# EAGLE design WakeUpLight (EAGLE 9.6.2)
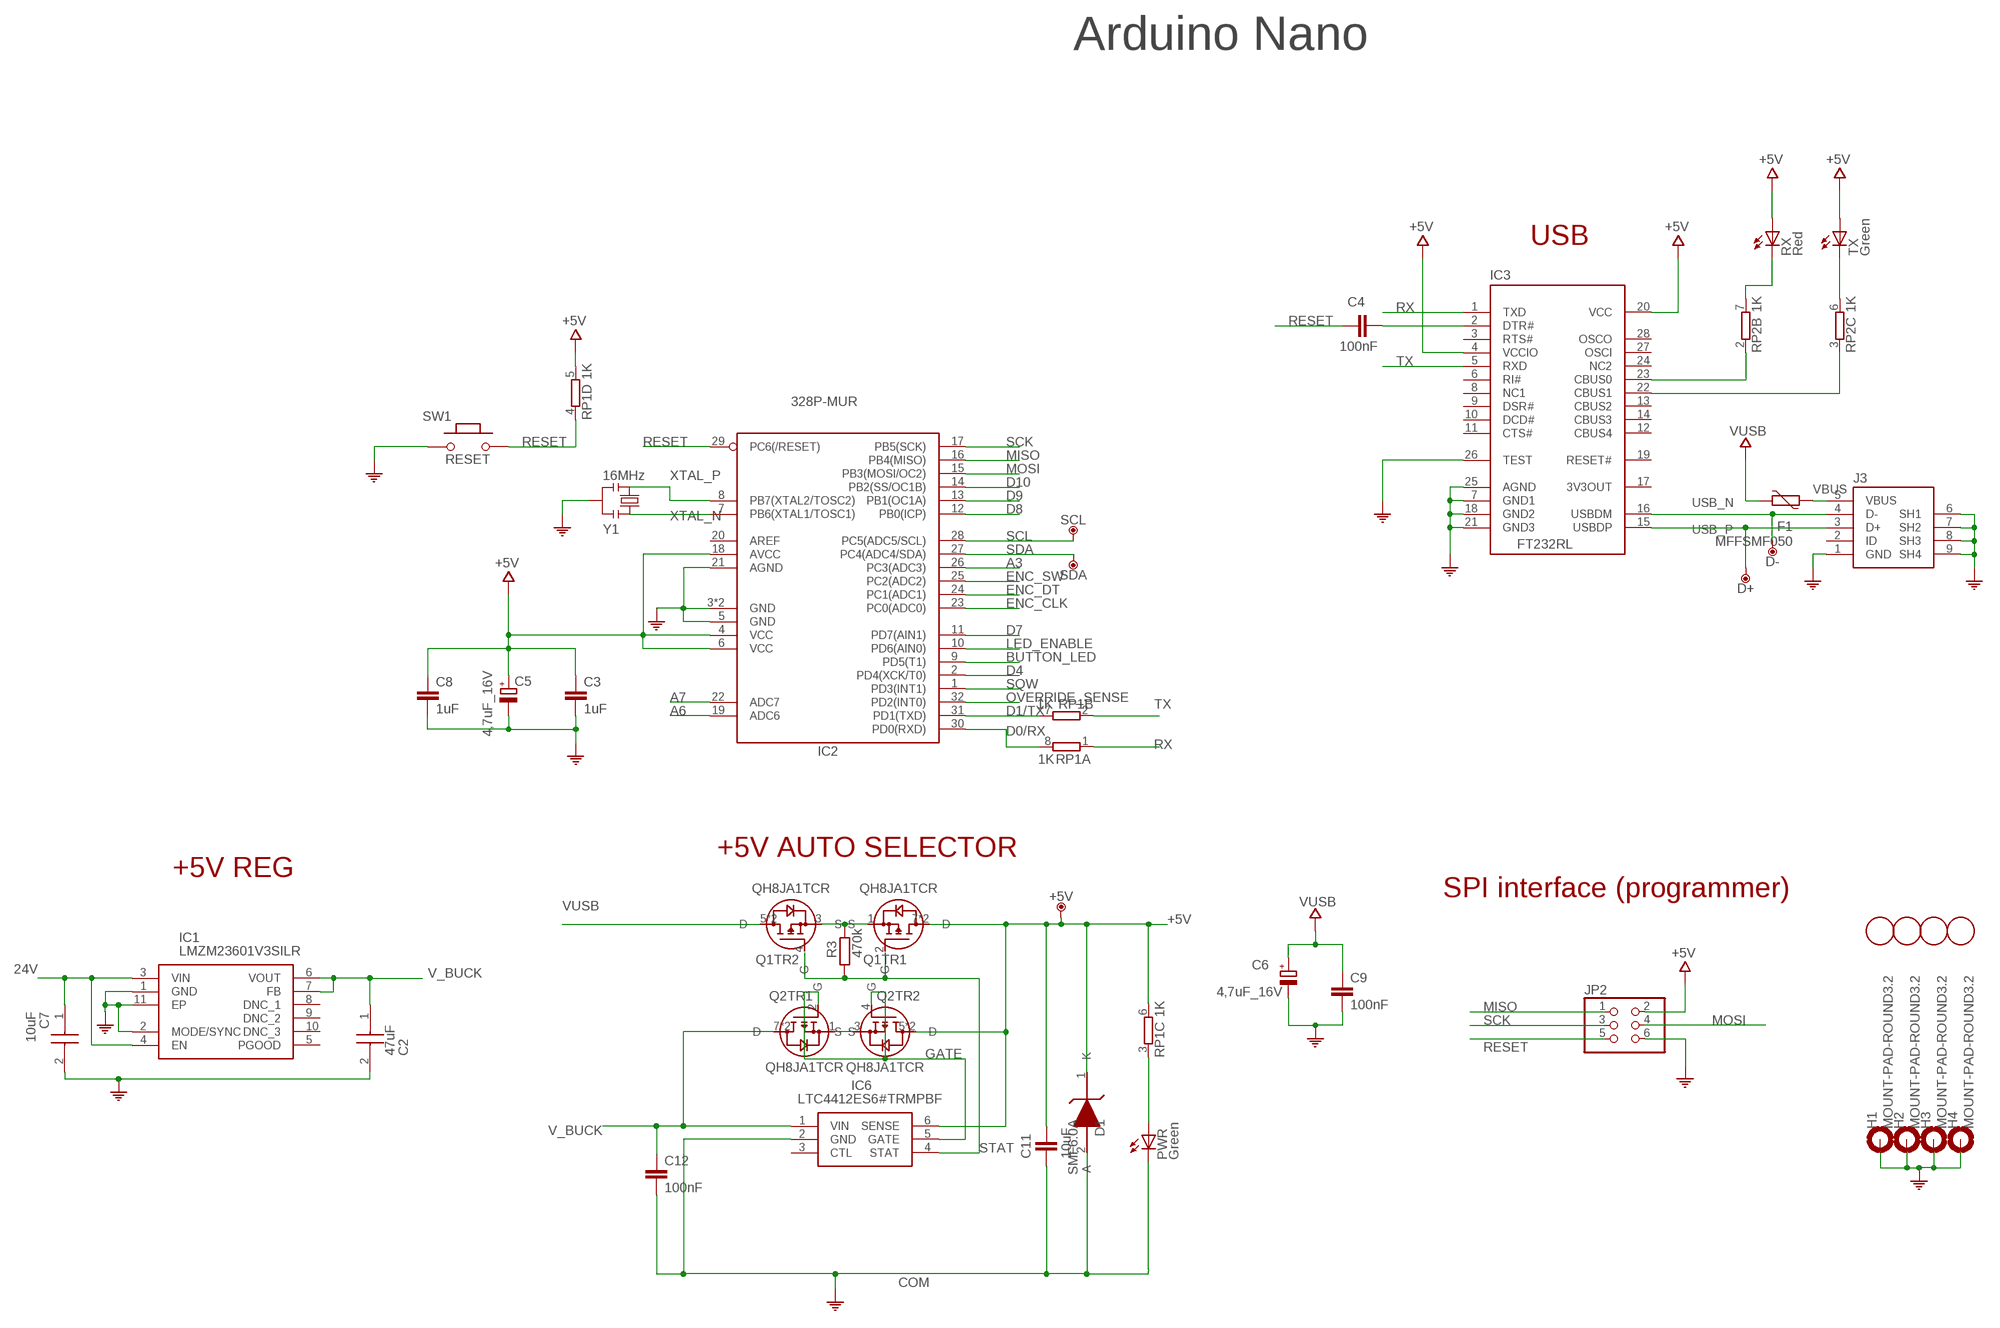
[diagram p0: schematic, sheet 1, part 1 of 2]
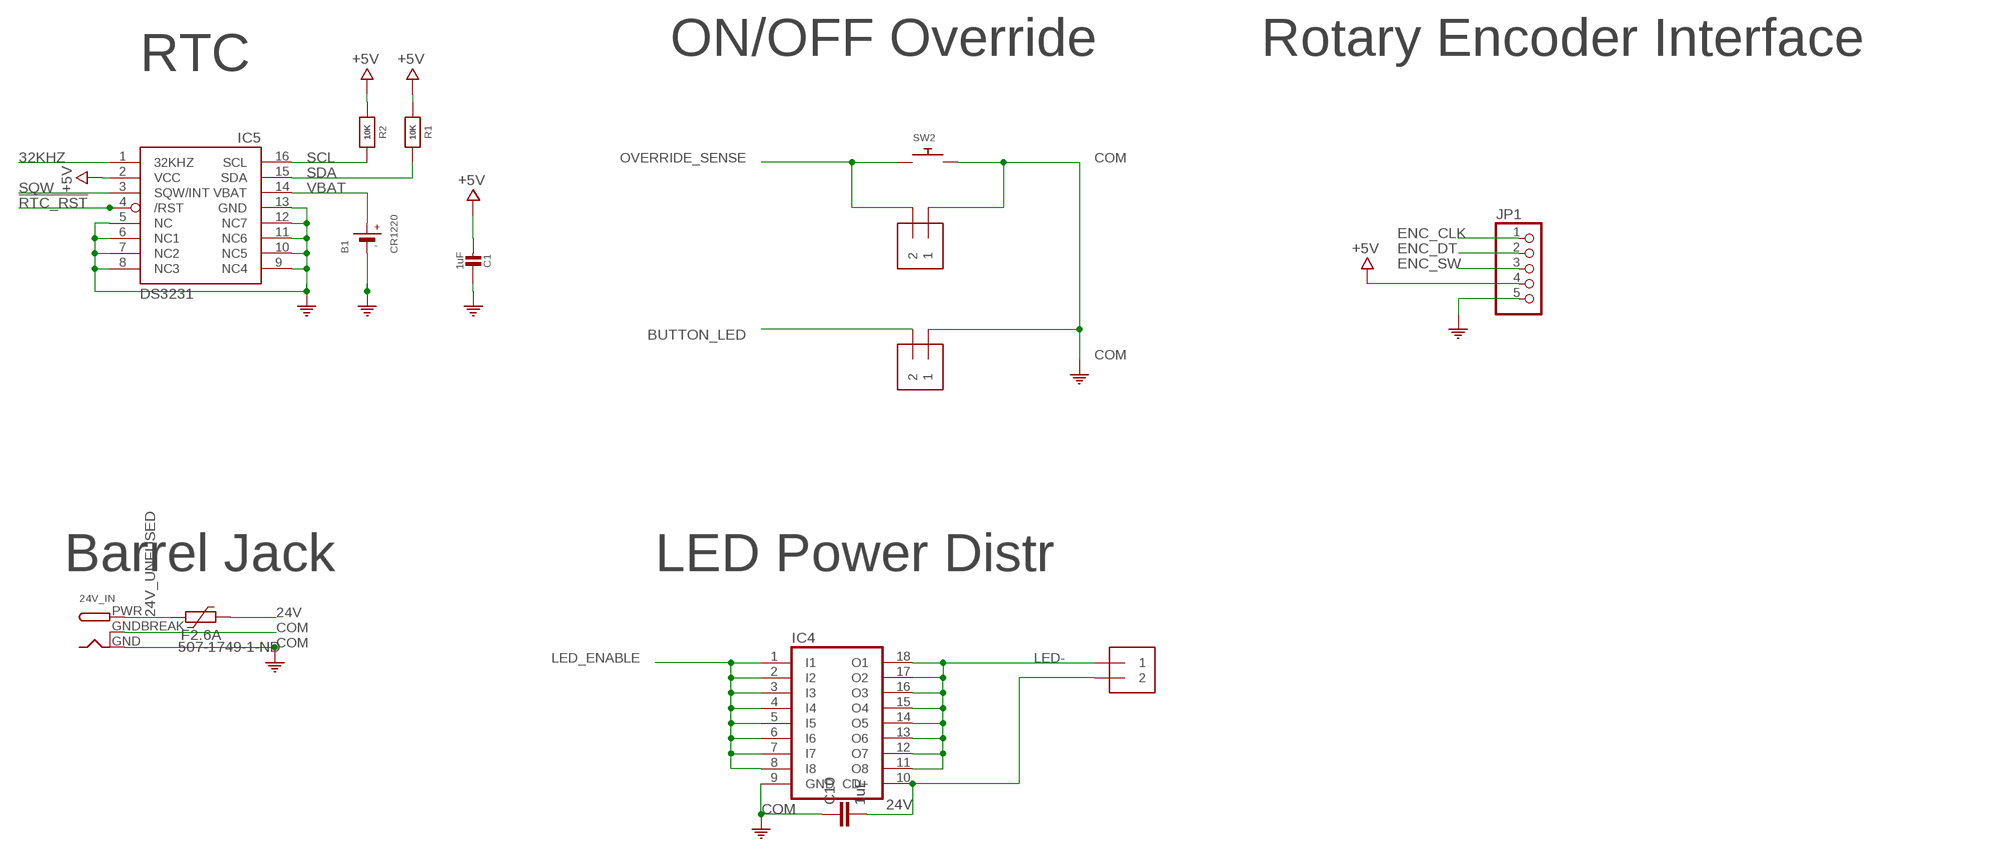
[diagram p1: schematic, sheet 1, part 2 of 2]

## Parts
24V_IN  DCBARRELPTH  [DCJACK_2MM_PTH]
+5V  DNP  TPTP-1.00MM  [TP-1.00MM]
B1  CR1220  BATTERYCR1220_SMT  [CR1220]
BUTTON_LED  1X2-3.5MM  [1X2-3.5MM]
C1  1uF  CAP_CERAMIC0805-NOOUTLINE  [0805-NO]
C2  47uF  C3216X5R1E476M160AC  [CAPC3216X180N]
C3  1uF  0006_1UF_0603/GRM188R61E105KA12D  [C0603-ROUND]
C4  100nF  0015_100NF_0603  [C0603-ROUND]
C5  4,7uF_16V  0833_TAJA475MO16RNJ  [TAN-A]
C6  4,7uF_16V  0833_TAJA475MO16RNJ  [TAN-A]
C7  10uF  C2012X5R1V106K085AC  [CAPC2012X100N]
C8  1uF  0006_1UF_0603/GRM188R61E105KA12D  [C0603-ROUND]
C9  100nF  0015_100NF_0603  [C0603-ROUND]
C10  1uF  0006_1UF_0603/GRM188R61E105KA12D  [C0603-ROUND]
C11  10uF  CC0603  [C0603]
C12  100nF  0015_100NF_0603  [C0603-ROUND]
D1  SMF6.0A  [SODFL3618X108N]
D+  DNP  TPTP-1.00MM  [TP-1.00MM]
D-  DNP  TPTP-1.00MM  [TP-1.00MM]
F1  MFFSMF050  PTC  [0603-1608X90N]
F2.6A  507-1749-1-ND  2016L260/24  [2016L]
H1  MOUNT-PAD-ROUND3.2  [3,2-PAD]
H2  MOUNT-PAD-ROUND3.2  [3,2-PAD]
H3  MOUNT-PAD-ROUND3.2  [3,2-PAD]
H4  MOUNT-PAD-ROUND3.2  [3,2-PAD]
IC1  LMZM23601V3SILR  [LMZM23600SILT]
IC2  328P-MUR  ATMEGA328P-32MUR  [VQFN32]
IC3  FT232RL  0226_FT232RL  [SSOP28]
IC4  ULN2803ASMT  [SO18W]
IC5  DS3231/SO  [SO16W]
IC6  LTC4412ES6#TRMPBF  [SOT95P280X100-6N]
J3  0219_14850  [USB-MINI-B_2]
JP1  PINHD-1X5  [1X05]
JP2  0114_PH254-203DF118A00V  [2X03]
LED  1X2-3.5MM  [1X2-3.5MM]
OVERRIDE  1X2-3.5MM  [1X2-3.5MM]
PWR  Green  0043_KPT-2012SGC  [CHIPLED_0805]
Q1  QH8JA1TCR  [SOTFL65P280X85-8N]
Q2  QH8JA1TCR  [SOTFL65P280X85-8N]
R1  10K  RESISTOR0805_NOOUTLINE  [0805-NO]
R2  10K  RESISTOR0805_NOOUTLINE  [0805-NO]
R3  470k  RR0603  [R0603]
RP1  1K  0005_064R_1K_/_CAY16-102J4LF  [CAY16]
RP2  1K  0005_064R_1K_/_CAY16-102J4LF  [CAY16]
RX  Red  0181_KTP-2012SURCK  [CHIPLED_0805]
SCL  DNP  TPTP-1.00MM  [TP-1.00MM]
SDA  DNP  TPTP-1.00MM  [TP-1.00MM]
SW1  RESET  0173_IT-1185AP1C-160G-G_T&R  [SMD_157SW]
SW2  SWITCH_PUSHBUTTONSOFTTOUCHSMD_SJ  [PUSHBUTTON_SMD_SJ]
TX  Green  0043_KPT-2012SGC  [CHIPLED_0805]
U$36  DNP  FIDUCIAL-1.5MM  [FD-1-1.5]
U$39  DNP  FIDUCIAL-1.5MM  [FD-1-1.5]
U$53  DNP  FIDUCIAL-1.5MM  [FD-1-1.5]
U$54  DNP  FIDUCIAL-1.5MM  [FD-1-1.5]
Y1  16MHz  0011_CSTCE16M0V53-R0  [RESONATOR]

## Nets
24V [hipower]: C7.1 C10.2 F2.6A.2 IC1.3(VIN) IC1.4(EN) IC4.10(CD+) LED.2
24V_UNFUSED: 24V_IN.PWR F2.6A.1
32KHZ: IC5.1(32KHZ)
!RTC_RST: IC5.4(/RST)
+5V [power]: +5V.X C1.2 C3.1 C5.1(+) C8.1 C11.1 D1.1(K) IC2.4(VCC) IC2.6(VCC) IC2.18(AVCC) IC3.4(VCCIO) IC3.20(VCC) IC5.2(VCC) IC6.6(SENSE) JP1.4 JP2.2 Q1.7(TR1:D) Q1.8(TR1:D) Q2.5(TR2:D) Q2.6(TR2:D) R1.1 R2.1 RP1.5 RP1.6 RX.A TX.A
A3: IC2.26(PC3(ADC3))
A6: IC2.19(ADC6)
A7: IC2.22(ADC7)
BUTTON_LED: BUTTON_LED.2 IC2.9(PD5(T1))
COM [power]: 24V_IN.GND 24V_IN.GNDBREAK B1.- BUTTON_LED.1 C1.1 C2.2 C3.2 C5.2(-) C6.2(-) C7.2 C8.2 C9.2 C10.1 C11.2 C12.2 D1.2(A) H1.B3,2(MOUNT) H2.B3,2(MOUNT) H3.B3,2(MOUNT) H4.B3,2(MOUNT) IC1.1(GND) IC1.2(MODE/SYNC) IC1.11(EP) IC2.3(GND) IC2.5(GND) IC2.21(AGND) IC2.33(GND) IC3.7(GND1) IC3.18(GND2) IC3.21(GND3) IC3.25(AGND) IC3.26(TEST) IC4.9(GND) IC5.5(NC) IC5.6(NC1) IC5.7(NC2) IC5.8(NC3) IC5.9(NC4) IC5.10(NC5) IC5.11(NC6) IC5.12(NC7) IC5.13(GND) IC6.2(GND) J3.1(GND) J3.6(SH1) J3.7(SH2) J3.8(SH3) J3.9(SH4) JP1.5 JP2.6 OVERRIDE.1 PWR.C SW1.1 SW2.P$2 Y1.2
D0/RX: IC2.30(PD0(RXD)) RP1.8
D1/TX: IC2.31(PD1(TXD)) RP1.7
D4: IC2.2(PD4(XCK/T0))
D7: IC2.11(PD7(AIN1))
D8: IC2.12(PB0(ICP))
D9: IC2.13(PB1(OC1A))
D10: IC2.14(PB2(SS/OC1B))
ENC_CLK: IC2.23(PC0(ADC0)) JP1.1
ENC_DT: IC2.24(PC1(ADC1)) JP1.2
ENC_SW: IC2.25(PC2(ADC2)) JP1.3
GATE: IC6.5(GATE) Q2.2(TR1:G) Q2.4(TR2:G)
LED- [hipower]: IC4.11(O8) IC4.12(O7) IC4.13(O6) IC4.14(O5) IC4.15(O4) IC4.16(O3) IC4.17(O2) IC4.18(O1) LED.1
LED_ENABLE: IC2.10(PD6(AIN0)) IC4.1(I1) IC4.2(I2) IC4.3(I3) IC4.4(I4) IC4.5(I5) IC4.6(I6) IC4.7(I7) IC4.8(I8)
MISO: IC2.16(PB4(MISO)) JP2.1
MOSI: IC2.15(PB3(MOSI/OC2)) JP2.4
N$1: Q1.1(TR1:S) Q1.3(TR2:S) R3.2
N$3: PWR.A RP1.3
N$4: C4.2 IC3.2(DTR#)
N$8: IC3.23(CBUS0) RP2.2
N$9: IC3.22(CBUS1) RP2.3
N$11: RP2.6 TX.C
N$18: Q2.1(TR1:S) Q2.3(TR2:S)
N$29: RP2.7 RX.C
OVERRIDE_SENSE: IC2.32(PD2(INT0)) OVERRIDE.2 SW2.P$1
RESET: C4.1 IC2.29(PC6(/RESET)) JP2.5 RP1.4 SW1.2
RX: IC3.1(TXD) RP1.1
SCK: IC2.17(PB5(SCK)) JP2.3
SCL: IC2.28(PC5(ADC5/SCL)) IC5.16(SCL) R2.2 SCL.X
SDA: IC2.27(PC4(ADC4/SDA)) IC5.15(SDA) R1.2 SDA.X
SQW: IC2.1(PD3(INT1)) IC5.3(SQW/INT)
STAT: IC6.4(STAT) Q1.2(TR1:G) Q1.4(TR2:G) R3.1
TX: IC3.5(RXD) RP1.2
USB_N [differential-pair]: D-.X IC3.16(USBDM) J3.4(D-)
USB_P [differential-pair]: D+.X IC3.15(USBDP) J3.3(D+)
V_BUCK [power]: C2.1 C12.1 IC1.6(VOUT) IC1.7(FB) IC6.1(VIN) Q2.7(TR1:D) Q2.8(TR1:D)
VBAT [power]: B1.+$1(+) IC5.14(VBAT)
VBUS [power]: F1.2 J3.5(VBUS)
VUSB [power]: C6.1(+) C9.1 F1.1 Q1.5(TR2:D) Q1.6(TR2:D)
XTAL_N: IC2.7(PB6(XTAL1/TOSC1)) Y1.1
XTAL_P: IC2.8(PB7(XTAL2/TOSC2)) Y1.3
Unconnected: IC1.5(PGOOD) IC1.8(DNC_1) IC1.9(DNC_2) IC1.10(DNC_3) IC2.20(AREF) IC3.3(RTS#) IC3.6(RI#) IC3.8(NC1) IC3.9(DSR#) IC3.10(DCD#) IC3.11(CTS#) IC3.12(CBUS4) IC3.13(CBUS2) IC3.14(CBUS3) IC3.19(RESET#) IC3.24(NC2) IC3.27(OSCI) IC3.28(OSCO) IC6.3(CTL) J3.2(ID) RP2.1 RP2.4 RP2.5 RP2.8

## Notes on the sheet
- Arduino Nano
- USB
- RTC | ON/OFF Override | Rotary Encoder Interface
- +5V AUTO SELECTOR
- +5V REG
- SPI interface (programmer)
- Barrel Jack | LED Power Distr

## Power pins joined to a net without a drawn wire
3V3OUT: IC3.17(3V3OUT)

## Library data of the parts
24V_IN = adafruit:DCBARREL: 2.0mm DC Barrel Jack DCJACK_2MM_PTH - Through Hole Jack (4UConnector: 05537)
+5V D+ D- SCL SDA = Arduino-utility:TP: Testpoint; DATASHEET: DNP; DISTRIBUTOR-LINK: DNP; DISTRIBUTOR-PN: DNP; MANUFACTURER: DNP; MANUFACTURER-PN: DNP
B1 = microbuilder:BATTERY: CR1220 SMT - Digikey: 3001K-ND CD2032 BAT-HLD-001 - Digikey: BAT-HLD-001-ND
BUTTON_LED LED OVERRIDE = adafruit:1X2: 3.5mm Terminal block http://www.ladyada.net/library/pcb/eaglelibrary.html
C1 = microbuilder:CAP_CERAMIC: Ceramic Capacitors For new designs, use the packages preceded by an '_' character since they are more reliable: The following footprints should be used on most boards: _0402 - Standard footprint for regular board layouts _0603 - Standard footprint for regular board layouts _0805 - Standard footprint for regular board layouts _1206 - Standard footprint for regular board layouts For extremely tight-pitch boards where space is at a premium, the following 'micro-pitch' footprints can be used (smaller pads, no silkscreen outline, etc.): _0402MP - Micro-pitch footprint for very dense/compact boards _0603MP - Micro-pitch footprint for very dense/compact boards _0805MP - Micro-pitch footprint for very dense/compact boards _1206MP - Micro-pitch footprint for very dense/compact boards
C2 = SamacSys_Parts:C3216X5R1E476M160AC: 1206 X5R ceramic capacitor 47uF 25V TDK 1206 C 47??F Ceramic Multilayer Capacitor, 25 V dc X5R Dielectric ??20% SMD Source: Datasheet <https://product.tdk.com/info/en/catalog/datasheets/mlcc_commercial_midvoltage_en.pdf>; ARROW_PART_NUMBER: C3216X5R1E476M160AC; ARROW_PRICE-STOCK: https://www.arrow.com/en/products/c3216x5r1e476m160ac/tdk; DESCRIPTION: 1206 X5R ceramic capacitor 47uF 25V TDK 1206 C 47??F Ceramic Multilayer Capacitor, 25 V dc X5R Dielectric ??20% SMD; HEIGHT: 1.8mm; MANUFACTURER_NAME: TDK; MANUFACTURER_PART_NUMBER: C3216X5R1E476M160AC; MOUSER_PART_NUMBER: 810-C3216X5R1E476M; MOUSER_PRICE-STOCK: https://www.mouser.co.uk/ProductDetail/TDK/C3216X5R1E476M160AC?qs=NRhsANhppD%252BqapdVvBvu4Q%3D%3D
C3 C8 C10 = Condensatori:0006_1UF_0603/GRM188R61E105KA12D: 1uF 0603; CASE: 0603; MONTHLY_USAGE: _____; PART_NUMBER: 1uF_0603/GRM188R61E105KA12D; PRICE: _____; SUPPLIER: _____; TYPE: Condensatori
C4 C9 C12 = Condensatori:0015_100NF_0603: 100nF 0603 50V; CASE: 0603; MONTHLY_USAGE: _____; PART_NUMBER: cl10b104kbnc; PRICE: _____; SUPPLIER: _____; TYPE: Condensatori
C5 C6 = Condensatori:0833_TAJA475MO16RNJ: 4,7uF; CASE: Case_A_(1206); MONTHLY_USAGE: _____; PART_NUMBER: TAJA475MO16RNJ; PRICE: _____; SUPPLIER: _____; TYPE: Condensatori
C7 = SamacSys_Parts:C2012X5R1V106K085AC: Capacitor MLCC 0805 35V 10uF X5R TDK 10uF Multilayer Ceramic Capacitor (MLCC) 35 V dc +/-10% X5R dielectric C SMT max op. temp. +85C Source: Datasheet <https://product.tdk.com/en/search/capacitor/ceramic/mlcc/info?part_no=C2012X5R1V106K085AC>; ARROW_PART_NUMBER: C2012X5R1V106K085AC; ARROW_PRICE-STOCK: https://www.arrow.com/en/products/c2012x5r1v106k085ac/tdk; DESCRIPTION: Capacitor MLCC 0805 35V 10uF X5R TDK 10uF Multilayer Ceramic Capacitor (MLCC) 35 V dc +/-10% X5R dielectric C SMT max op. temp. +85C; HEIGHT: 1mm; MANUFACTURER_NAME: TDK; MANUFACTURER_PART_NUMBER: C2012X5R1V106K085AC; MOUSER_PART_NUMBER: 810-C2012X5R1V106K0C; MOUSER_PRICE-STOCK: https://www.mouser.co.uk/ProductDetail/TDK/C2012X5R1V106K085AC?qs=6JAMGB%252BEdky%252BlYMcTLhFyA%3D%3D
C11 = eagle-ltspice:C: CAPACITOR, European symbol; MPN: GRM188R61E106MA73D; POPULATE: 1; SPICEMODEL: NONE; SPICEPREFIX: C
D1 = SamacSys_Parts:SMF: ESD Suppressors / TVS Diodes TVS SMF Uni-Directional Source: Datasheet <https://www.littelfuse.com/~/media/electronics/datasheets/tvs_diodes/littelfuse_tvs_diode_smf_datasheet.pdf.pdf>; DIGIKEY-PN: F5749CT-ND; POPULATE: 1
F1 = Arduino-rcl:PTC: SMD PTC; DATASHEET: http://www.bourns.com/docs/Product-Datasheets/mffsmf.pdf; DISTRIBUTOR-LINK: http://www.digikey.com/product-detail/en/bourns-inc/MF-FSMF050X-2/MF-FSMF050X-2CT-ND/2039389; DISTRIBUTOR-PN: MF-FSMF050X-2CT-ND; MANUFACTURER: Bourns Inc; MANUFACTURER-PN: MF-FSMF050X-2
F2.6A = polyfuse-smd_20:?: Polyfuse Resettable PTC Source: http://www.littelfuse.com/products/resettable-ptcs.aspx; MF: Littelfuse; MPN: 0ZCF0200AF2C; OC_FARNELL: unknown; OC_NEWARK: unknown
H1-H4 = holes:MOUNT-PAD-ROUND: MOUNTING PAD, round
IC1 = SamacSys_Parts:LMZM23601V3SILR: 36-V, 1-A Step-Down DC-DC Power Module in 3.8-mm 3-mm Package Source: Datasheet <http://www.ti.com/lit/ds/symlink/lmzm23601.pdf>; ARROW_PART_NUMBER: LMZM23601V3SILR; ARROW_PRICE-STOCK: https://www.arrow.com/en/products/lmzm23601v3silr/texas-instruments; DESCRIPTION: 36-V, 1-A Step-Down DC-DC Power Module in 3.8-mm 3-mm Package; HEIGHT: 1.578mm; MANUFACTURER_NAME: Texas Instruments; MANUFACTURER_PART_NUMBER: LMZM23601V3SILR; MOUSER_PART_NUMBER: 595-LMZM23601V3SILR; MOUSER_PRICE-STOCK: https://www.mouser.co.uk/ProductDetail/Texas-Instruments/LMZM23601V3SILR?qs=W0yvOO0ixfHvtV7rqSaAlA%3D%3D
IC2 = Arduino-ucs&SoCs:ATMEGA328P-32: 8-bit Microcontroller with 32KBytes In-System Programmable Flash ATMEGA328P-AU; DATASHEET: http://www.atmel.com/images/Atmel-8271-8-bit-AVR-Microcontroller-ATmega48A-48PA-88A-88PA-168A-168PA-328-328P_datasheet_Complete.pdf; DISTRIBUTOR-LINK: https://www.digikey.it/product-detail/it/microchip-technology/ATMEGA328P-MUR/ATMEGA328P-MURCT-ND/3440953; DISTRIBUTOR-PN: ATMEGA328P-MURCT-ND; MANUFACTURER: ATMEL; MANUFACTURER-PN: ATMEGA328P-MUR
IC3 = IntegratedCircuits:0226_FT232RL: USB to serial UART interface -FT232RL; CASE: SSOP28; MONTHLY_USAGE: _____; PART_NUMBER: FT232RL; PRICE: _____; SUPPLIER: _____; TYPE: Circuito_Integrato
IC4 = uln-udn-custom:ULN2803A: DRIVER ARRAY https://www.ti.com/lit/ds/symlink/uln2803a.pdf; DATASHEET: https://www.ti.com/lit/ds/symlink/uln2803a.pdf; INPUTVOLT: 3-5V; PARALLELIO: 8
IC5 = adafruit:DS3231
IC6 = SamacSys_Parts:LTC4412ES6#TRMPBF: Hot Swap Controller LTC4412ES6#TRMPBF, Positive Voltage, 2.5 28 V, TSOT-23, 6-Pin Source: Datasheet <https://componentsearchengine.com/Datasheets/1/LTC4412ES6#TRMPBF.pdf>; DESCRIPTION: Hot Swap Controller LTC4412ES6#TRMPBF, Positive Voltage, 2.5 28 V, TSOT-23, 6-Pin; HEIGHT: 1mm; MANUFACTURER_NAME: Linear Technology; MANUFACTURER_PART_NUMBER: LTC4412ES6#TRMPBF; MOUSER_PART_NUMBER: 584-LTC4412ES6TRMPBF; MOUSER_PRICE-STOCK: https://www.mouser.com/Search/Refine.aspx?Keyword=584-LTC4412ES6TRMPBF; POPULATE: 1
J3 = Connettori:0219_14850: Usb-Mini F 90 Smd; MONTHLY_USAGE: _____; PART_NUMBER: 14850; PRICE: _____; SUPPLIER: _____; TYPE: Connettori; VALUE: USB-mini-90 -SMD
JP1 = pinhead-custom:PINHD-1X5: PIN HEADER
JP2 = Connettori:0114_PH254-203DF118A00V: 3x2 M V h 8,5 mm p2,54; MONTHLY_USAGE: _____; PART_NUMBER: PH254-203DF118A00V; PRICE: _____; SUPPLIER: _____; TYPE: Connettori; VALUE: ICSP
PWR TX = Opto:0043_KPT-2012SGC: LED GREEN - SMD-0805; MONTHLY_USAGE: _____; PART_NUMBER: KPT-2012SGC; PRICE: _____; SUPPLIER: _____; TYPE: Opto
Q1 Q2 = SamacSys_Parts:QH8JA1TCR: -20V Pch+Pch Middle Power MOSFET Source: Datasheet <https://www.mouser.com/datasheet/2/348/qh8ja1tcr-e-1138736.pdf>; DATASHEET: https://www.mouser.com/datasheet/2/348/qh8ja1tcr-e-1138736.pdf; DIGIKEY-PN: QH8JA1TCRCT-ND; MPN: QH8JA1TCR; POPULATE: 1
R1 R2 = microbuilder:RESISTOR: Resistors For new designs, use the packages preceded by an '_' character since they are more reliable: The following footprints should be used on most boards: _0402 - Standard footprint for regular board layouts _0603 - Standard footprint for regular board layouts _0805 - Standard footprint for regular board layouts _1206 - Standard footprint for regular board layouts For extremely tight-pitch boards where space is at a premium, the following 'micro-pitch' footprints can be used (smaller pads, no silkscreen outline, etc.): _0402MP - Micro-pitch footprint for very dense/compact boards _0603MP - Micro-pitch footprint for very dense/compact boards _0805MP - Micro-pitch footprint for very dense/compact boards _1206MP - Micro-pitch footprint for very dense/compact boards
R3 = eagle-ltspice:R: RESISTOR, European symbol; POPULATE: 1; SPICEMODEL: NONE; SPICEPREFIX: R
RP1 RP2 = Resistenze:0005_064R_1K_/_CAY16-102J4LF: 1K 064R; CASE: SMD_3,2x1,6; MONTHLY_USAGE: _____; PART_NUMBER: 064R_1K_/_CAY16-102J4LF; PRICE: _____; SUPPLIER: _____; TYPE: Resistenze
RX = Opto:0181_KTP-2012SURCK: LED RED - SMD - 0805; MONTHLY_USAGE: _____; PART_NUMBER: KTP-2012SURCK; PRICE: _____; SUPPLIER: _____; TYPE: Opto
SW1 = Switches:0173_IT-1185AP1C-160G-G_T&R: Pushbutton 4x3 SMD H2,5mm; MONTHLY_USAGE: _____; PART_NUMBER: IT-1185AP1C-160G-G_T&R; PRICE: _____; SUPPLIER: _____; TYPE: Switches; VALUE: 157SW
SW2 = adafruit:SWITCH_PUSHBUTTON: Buttons SOFTTOUCHSMD_SJ - Soft touch temporary push button (Super Junk Akihabara) Compatible with SKPMANE010 [Mouser: 688-SKPMAN] C&K_KSS = Digikey: KSS221GLFS
U$36 U$39 U$53 U$54 = Arduino-utility:FIDUCIAL: Fiducial mount; DATASHEET: DNP; DISTRIBUTOR-LINK: DNP; DISTRIBUTOR-PN: DNP; MANUFACTURER: DNP; MANUFACTURER-PN: DNP
Y1 = Cristalli:0011_CSTCE16M0V53-R0: 16Mhz - SMD; MONTHLY_USAGE: _____; PART_NUMBER: CSTCE16M0V53-R0; PRICE: _____; SUPPLIER: _____; TYPE: Cristalli; VALUE: CSTCE16M0V53-R0

## Net classes
0 default: width 0.152 mm, drill 0.35 mm
1 power: width 0.254 mm, drill 0.018 mm
2 hipower: width 1.016 mm, drill 0.7 mm
3 differential-pair: clearance 0.152 mm

## Board
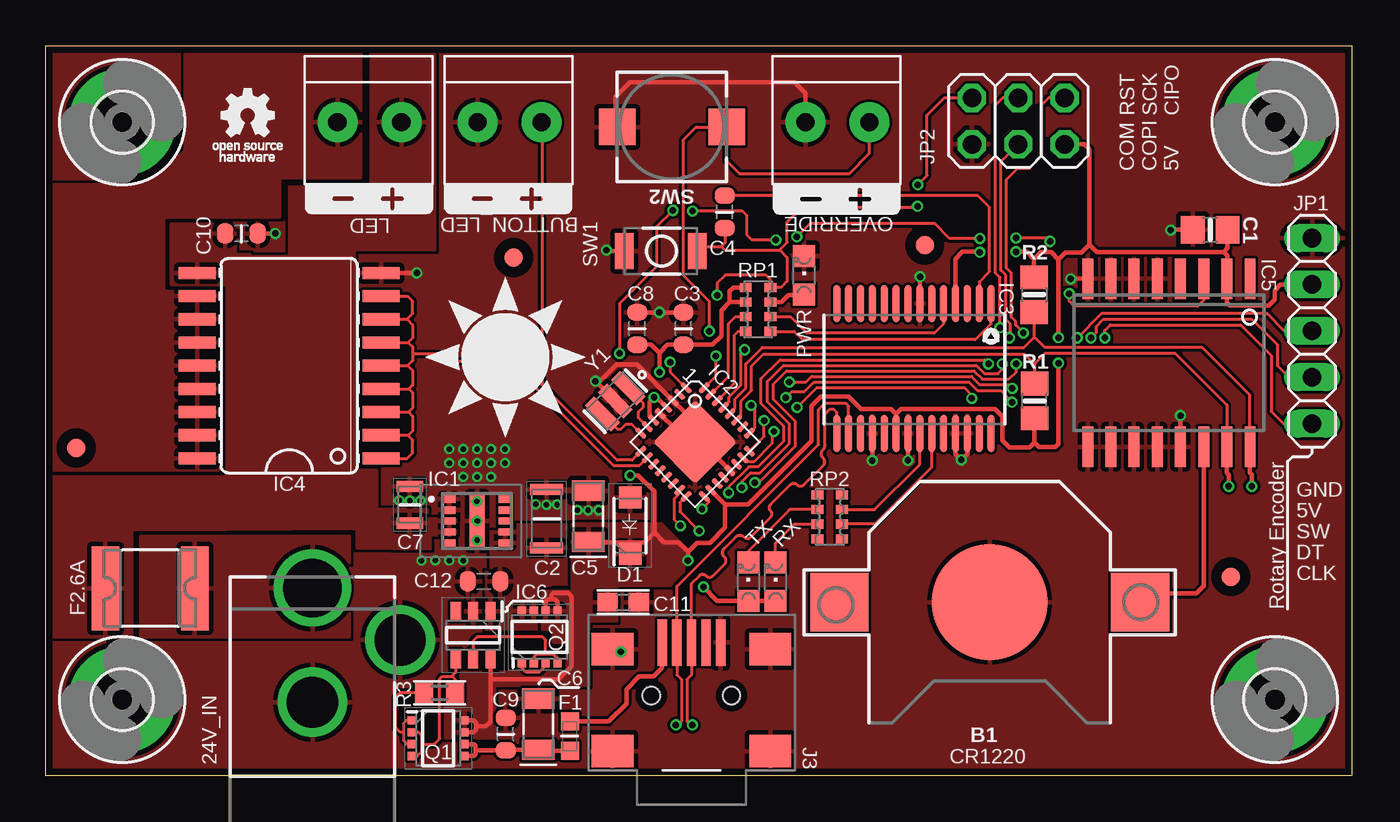
[diagram p2: board, top side]
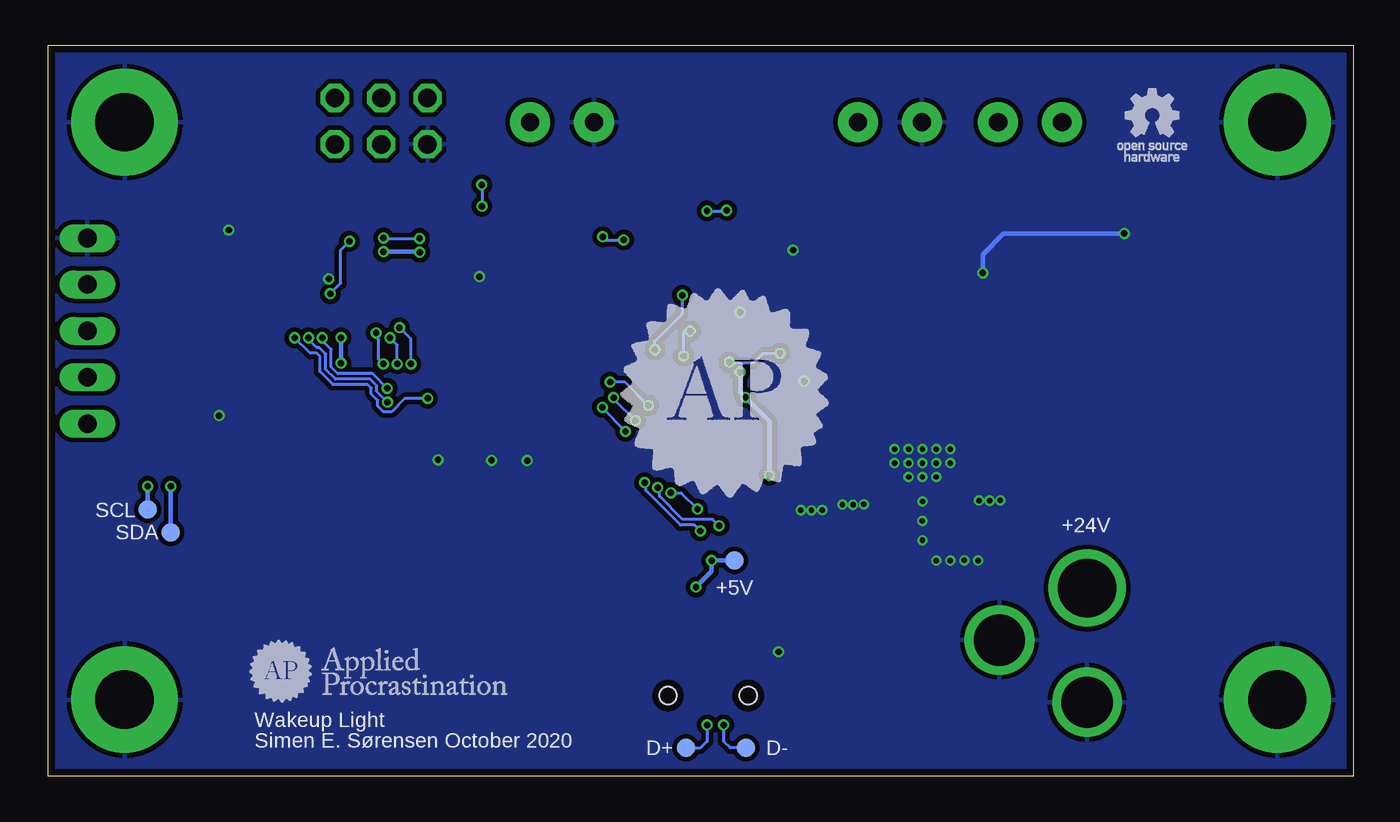
[diagram p3: board, bottom side, seen from below]

Size 71.52 x 40 mm. Coordinates in mm from the lower left corner, seen from the top.
Outline: 0,40 71.52,40 71.52,0 0,0 0,40
Copper layers (1*16): Top 0.035559375mm / dielectric 1.6mm / Bottom 0.035559375mm
Design rules "oshpark-2layer *": minimum track width 6mil, minimum drill 10mil, track to track 6mil, track to pad 6mil, pad to pad 6mil, via to via 6mil, smd to smd 6mil, copper to edge 15mil, drill to drill 6mil, minimum pad ring 5mil, minimum via ring 5mil, stop-mask expansion 2.5mil, vias tented up to drill 20mil, thermal gap 10mil

### Footprints (pad centres in the part's own frame; a part is rotated, then mirrored left to right if it is on the bottom)
DCJACK_2MM_PTH = drill 2.8: GND 0,7.35; GNDBREAK 4.8,10.75 | drill 3.2: PWR 0,13.6
TP-1.00MM = smd 1 x 1 bottom: X 0,0
CR1220 = smd 3.2 x 3.2: +$1 -8.225,0; +$2 8.225,0 | smd 6.35 x 6.35: - 0,0
1X2-3.5MM = drill 1 pad 2.184: 1 1.8,0; 2 -1.7,0
0805-NO = smd 1.3 x 1.5: 1 -0.95,0; 2 0.95,0
CAPC3216X180N = smd 0.62 x 1.82: 1 -1.6,0; 2 1.6,0
C0603-ROUND = smd 0.898 x 1.1: 1 -0.889,0; 2 0.889,0
TAN-A = smd 1.118 x 1.778: 1 0,0; 2 2.794,0
CAPC2012X100N = smd 0.62 x 1.47: 1 -1,0; 2 1,0
C0603 = smd 1.1 x 1: 1 -0.85,0; 2 0.85,0
SODFL3618X108N = smd 1.2 x 1.22: 1 -1.55,0; 2 1.55,0
0603-1608X90N = smd 0.95 x 1: 1 -0.8,0; 2 0.8,0
2016L = smd 1.5 x 4.6: 1 -2.45,0; 2 2.45,0
3,2-PAD = drill 3.2 pad 5.842: B3,2 0,0
LMZM23600SILT = smd 0.7 x 0.4: 1 -1.525,1.2; 2 -1.525,0.6; 3 -1.525,0; 4 -1.525,-0.6; 5 -1.525,-1.2; 6 1.525,-1.2; 7 1.525,-0.6; 8 1.525,0; 9 1.525,0.6; 10 1.525,1.2 | smd 0.8 x 3: 11 0,0
VQFN32 = smd 0.7 x 0.28: 1 -2.45,1.75; 2 -2.45,1.25; 3 -2.45,0.75; 4 -2.45,0.25; 5 -2.45,-0.25; 6 -2.45,-0.75; 7 -2.45,-1.25; 8 -2.45,-1.75; 17 2.45,-1.75; 18 2.45,-1.25; 19 2.45,-0.75; 20 2.45,-0.25; 21 2.45,0.25; 22 2.45,0.75; 23 2.45,1.25; 24 2.45,1.75 | smd 0.28 x 0.7: 9 -1.75,-2.45; 10 -1.25,-2.45; 11 -0.75,-2.45; 12 -0.25,-2.45; 13 0.25,-2.45; 14 0.75,-2.45; 15 1.25,-2.45; 16 1.75,-2.45; 25 1.75,2.45; 26 1.25,2.45; 27 0.75,2.45; 28 0.25,2.45; 29 -0.25,2.45; 30 -0.75,2.45; 31 -1.25,2.45; 32 -1.75,2.45 | smd 3.254 x 3.254: 33 0,0
SSOP28 = smd 0.381 x 2.032: 1 0,0; 2 0.65,0; 3 1.3,0; 4 1.95,0; 5 2.6,0; 6 3.25,0; 7 3.9,0; 8 4.55,0; 9 5.2,0; 10 5.85,0; 11 6.5,0; 12 7.15,0; 13 7.8,0; 14 8.45,0; 15 8.45,7.112; 16 7.8,7.112; 17 7.15,7.112; 18 6.5,7.112; 19 5.85,7.112; 20 5.2,7.112; 21 4.55,7.112; 22 3.9,7.112; 23 3.25,7.112; 24 2.6,7.112; 25 1.95,7.112; 26 1.3,7.112; 27 0.65,7.112; 28 0,7.112
SO18W = smd 0.66 x 2.032: 1 -5.08,-5.029; 2 -3.81,-5.029; 3 -2.54,-5.029; 4 -1.27,-5.029; 5 0,-5.029; 6 1.27,-5.029; 7 2.54,-5.029; 8 3.81,-5.029; 9 5.08,-5.029; 10 5.08,5.029; 11 3.81,5.029; 12 2.54,5.029; 13 1.27,5.029; 14 0,5.029; 15 -1.27,5.029; 16 -2.54,5.029; 17 -3.81,5.029; 18 -5.08,5.029
SO16W = smd 0.6 x 2.2: 1 -4.445,-4.6; 2 -3.175,-4.6; 3 -1.905,-4.6; 4 -0.635,-4.6; 5 0.635,-4.6; 6 1.905,-4.6; 7 3.175,-4.6; 8 4.445,-4.6; 9 4.445,4.6; 10 3.175,4.6; 11 1.905,4.6; 12 0.635,4.6; 13 -0.635,4.6; 14 -1.905,4.6; 15 -3.175,4.6; 16 -4.445,4.6
SOT95P280X100-6N = smd 1.05 x 0.55: 1 -1.3,0.95; 2 -1.3,0; 3 -1.3,-0.95; 4 1.3,-0.95; 5 1.3,0; 6 1.3,0.95
USB-MINI-B_2 = smd 0.508 x 2.54: 1 0,0; 2 0.8,0; 3 1.6,0; 4 2.4,0; 5 3.2,0 | smd 2.286 x 1.778: 6 -2.717,5.948; 7 -2.717,0.36; 8 5.918,0.36; 9 5.918,5.948 | hole 0.95: -0.6,2.9; 3.8,2.9
1X05 = drill 1.016 long: 1 -5.08,0; 2 -2.54,0; 3 0,0; 4 2.54,0; 5 5.08,0
2X03 = drill 1.016 pad 1.55 octagon: 1 -2.54,-1.27; 2 -2.54,1.27; 3 0,-1.27; 4 0,1.27; 5 2.54,-1.27; 6 2.54,1.27
CHIPLED_0805 = smd 1.2 x 1.2: A 0,-1.05; C 0,1.05
SOTFL65P280X85-8N = smd 0.47 x 0.45: 1 -1.435,0.975; 2 -1.435,0.325; 3 -1.435,-0.325; 4 -1.435,-0.975; 5 1.435,-0.975; 6 1.435,-0.325; 7 1.435,0.325; 8 1.435,0.975
R0603 = smd 1 x 1.1: 1 -0.85,0; 2 0.85,0
CAY16 = smd 0.5 x 0.65: 1 -1.2,-0.675; 2 -0.4,-0.675; 3 0.4,-0.675; 4 1.2,-0.675; 5 1.2,0.675; 6 0.4,0.675; 7 -0.4,0.675; 8 -1.2,0.675
SMD_157SW = smd 1.016 x 1.981: 1 0,0; 2 4,0
PUSHBUTTON_SMD_SJ = smd 2 x 2: P$1 3,0; P$2 -3,0
FD-1-1.5 = smd 1.016 x 1.016: P$1 0,0
RESONATOR = smd 0.7 x 2: 1 -1,0; 2 0,0; 3 1,0

### Placement (x,y rotation side)
24V_IN  14.61,-3.31 0 top
+5V  33.91,11.81 270 top
B1  51.69,9.52 180 top
BUTTON_LED  25.45,35.81 180 top
C1  63.76,29.92 0 top
C2  27.43,14.09 90 top
C3  34.92,24.51 90 top
C4  37.19,30.9 90 top
C5  29.72,12.82 90 top
C6  26.98,1.44 90 top
C7  19.94,14.85 90 top
C8  32.38,24.51 90 top
C9  25.18,2.3 90 top
C10  10.72,29.71 180 top
C11  31.62,9.52 0 top
C12  24,10.66 180 top
D1  32,13.71 90 top
D+  36.56,1.53 0 top
D-  33.29,1.53 0 top
F1  28.71,2.19 90 top
F2.6A  5.71,10.28 180 top
H1  4.19,35.81 0 top
H2  4.19,4.19 0 top
H3  67.31,4.19 0 top
H4  67.31,35.81 0 top
IC1  23.62,13.96 0 top
IC2  35.56,18.28 315 top
IC3  51.77,25.87 180 top
IC4  13.34,22.47 90 top
IC5  61.5,22.63 180 top
IC6  23.41,7.71 270 top
J3  36.96,7.31 180 top
JP1  69.34,24.38 90 top
JP2  53.26,35.87 180 top
LED  17.78,35.81 180 top
OVERRIDE  43.4,35.81 180 top
PWR  41.53,27.43 0 top
Q1  21.5,2.07 0 top
Q2  27.05,7.62 90 top
R1  54.14,20.54 90 top
R2  54.12,26.36 270 top
R3  21.57,4.56 180 top
RP1  39.01,25.55 90 top
RP2  42.94,14.19 90 top
RX  39.97,10.65 0 top
SCL  66.04,14.6 0 top
SDA  64.77,13.33 0 top
SW1  31.69,28.75 0 top
SW2  34.29,35.54 0 top
TX  38.48,10.65 0 top
U$15  [APPLIED-PROC]  34.29,20.95 0 bottom
U$19  [APPLIED-PROCRASTINATION-FULL-SMALL]  58.72,5.75 0 bottom
U$33  [WAKEUP-LIGHT-LOGO2]  25.15,22.86 0 top
U$34  [TB-PLUSMINUS-FLIP]  21.2,32.42 180 top
U$36  64.9,10.92 0 top
U$37  [OSHW-LOGO]  11.05,35.05 0 top
U$38  [TB-PLUSMINUS-FLIP]  46.81,32.4 180 top
U$39  25.62,28.39 0 top
U$41  [TB-PLUSMINUS-FLIP]  28.82,32.42 180 top
U$42  [OSHW-LOGO]  11.05,35.05 0 bottom
U$53  1.67,17.97 0 top
U$54  48.13,29.07 0 top
Y1  31.19,20.53 225 top

### Tracks (layer width: path | path; a pad name or v marks a point on that pad's centre or on a via)
24V
  pour Top: 4.74,13.52 9.91,13.52 17.02,13.55 17.02,12.5 21.08,12.44 21.08,13.2 22.48,13.2 22.48,14.09 20.9,14.09 20.9,14.6 18.16,14.6 18.16,16.73 16.93,16.73 16.92,28.82 21.34,28.82 21.34,39.87 17.78,39.87 17.78,32.25 13.34,32.25 13.34,28.44 11.18,28.44 11.18,28.57 10.41,28.57 10.41,30.22 6.86,30.22 6.86,26.92 9.91,26.92 9.91,16.38 0,16.38 0,7.62 4.74,7.62
24V_UNFUSED
  pour Top (isolate 0.254): 5.18,7.62 16.64,7.62 16.64,13.15 9.53,13.12 5.18,13.12
+5V  (via drill 0.35)
  Top 0.254: IC2.18 37.2,14.87 | 37.2,14.87 37.21,14.87 37.21,13.61 36.37,12.77 35.66,12.77 35.17,12.28 v35.17,11.8 35.17,12.29 34.66,12.8 33.85,12.8 33.33,13.33 | C5.1 29.74,12.8 32.8,12.8 32.8,12.81 33.33,13.33 | IC2.6 33.06,19.73 33.06,20.49 v33.31,20.74 33.46,20.74 IC2.4 | C8.1 33.14,23.62 33.6,23.16 | 37.45,25.95 37,25.5 37,24.1 36.52,23.62 C3.1 34.06,23.62 33.6,23.16 | 37.45,25.95 37.45,26.55 37.65,26.75 RP1.5 | RX.A TX.A 36.77,9.6 v36.02,10.35 | 37.2,14.87 38.47,14.87 41.93,18.34 41.93,20.25 42.45,20.78 43.96,20.78 44.64,20.1 46.29,20.1 46.56,19.82 IC3.20 46.56,19.82 46.84,20.1 51.97,20.1 52.39,19.68 52.39,18.38 52.76,18 53.86,18 54.1,18.25 | 64.5,28.7 64.7,28.5 64.7,27.26 IC5.2 64.67,25.93 64.83,25.78 66.98,25.78 67.29,26.08 67.29,26.6 67.61,26.92 JP1.4 | 64.5,28.7 64.71,28.91 C1.2 | v32,16.47 32.43,16.47 33.33,15.58 33.33,13.33 | 33.6,23.16 v33.6,22.13 v33.61,22.12 | IC3.4 49.81,28.32 50.2,28.71 51.12,28.71 v51.15,28.69 | 54.12,28.32 53.73,28.71 v53.14,28.71 v53.13,28.71 | 54.12,28.32 54.5,28.7 55.05,28.7 55.46,28.29 | 54.1,18.25 54.15,18.25 54.38,18.02 55.3,18.02 55.46,18.18 v55.46,22.61 | v55.46,24.01 55.46,28.29 | 54.1,18.25 54.14,18.28 R1.1 | R2.1 54.12,28.32 | 55.46,28.29 55.84,28.67 56.71,28.67 57.15,29.12 | 57.15,29.12 57.57,28.7 64.5,28.7 | JP2.2 56.88,34.6 57.15,34.33 57.15,29.12 | Q1.7 23.42,2.4 23.57,2.55 23.57,2.66 | 23.57,2.66 23.57,2.92 23.44,3.05 Q1.8 | 23.57,2.66 23.63,2.72 24.1,2.72 24.35,2.98 24.35,3.55 24.36,3.55 24.36,5.28 | 24.36,5.28 28.06,5.28 28.79,6.02 28.79,9.84 28.61,10.02 27.79,10.02 27.69,9.92 27.69,9.67 | 27.69,9.67 27.88,9.67 28.03,9.53 Q2.5
  Top 0.254: 27.69,9.67 27.5,9.67 27.38,9.55 Q2.6 | IC6.6 24.36,5.28 | 37.45,25.95 RP1.6
  Bottom 0.254: v33.61,22.12 33.61,21.04 v33.31,20.74 32,19.43 v32,16.47 | v51.15,28.69 51.17,28.71 v53.13,28.71 | v36.02,10.35 35.17,11.2 v35.17,11.8 +5V.X | v55.46,22.61 v55.46,24.01
  pour Top: 27.21,8.01 27.21,10.13 28.85,10.13 28.85,13.83 33.73,13.83 34.92,12.64 34.92,11.13 34.2,10.4 31.27,10.4 31.27,8.47 29.72,8.47 29.72,4.95 24.57,4.95 24.57,2.06 21.8,2.06 21.8,5.24 22.5,5.24 22.5,5.71 28.57,5.71 28.57,7.31 27.81,7.31 27.81,8.01
BUTTON_LED
  Top 0.152: IC2.9 32.11,17.3 31.29,17.3 27.18,21.42 27.18,35.78 BUTTON_LED.2
COM  (via drill 0.3, 0.35)
  Top 0.254: v20.32,27.55 IC4.9 | IC2.5 34.49,19 35,19 | 35,19 35,19.9 IC2.3 32.37,22.54 31.27,22.54 30.36,21.63 v30.1,21.63 v30.1,21.62 Y1.2 | IC2.21 35.91,18.28 IC2.33 35.56,18.42 35,18.98 35,19 | C8.2 v33.6,25.39 C3.2 | SW1.1 30.75,28.75 v30.7,28.8 | IC5.13 v62.13,19.73 | C1.1 61.62,29.92 v61.6,29.9 | IC3.18 v45.27,17.28 v45.26,17.27 | IC3.21 v47.22,17.29 v47.21,17.29 | IC3.7 47.87,27.34 v47.88,27.35 | J3.8 31.04,6.8 v31.5,6.8 | IC3.25 49.81,17.64 v50.14,17.32 50.47,17.64 IC3.26 | v12.57,29.71 C10.1 | SW2.P$2 31.2,35.54 31.2,37.2 32,38 41,38 41.6,37.4 OVERRIDE.1 | IC5.8 v56.13,27.23 v56.12,27.22
  Bottom 0.254: v12.57,29.71 19.18,29.71 20.32,28.57 v20.32,27.55
  other vias: 22.1,11.81 20.57,11.81 21.33,11.82 22.86,11.81 22.86,16.38 23.62,16.38 24.38,16.38 25.15,17.14 24.38,17.14 22.86,17.14 22.1,17.14 22.1,17.9 22.86,17.9 23.62,17.14 23.62,17.9 24.38,17.9 25.15,17.9 23.62,12.9 23.63,13.97 23.61,15.04 19.35,15.1 19.94,15.08 20.52,15.09 26.83,14.87 27.42,14.85 28,14.86 29.11,14.57 29.7,14.55 30.28,14.56
  pour Bottom (isolate 0.254): 0,40 0,0 71.52,0 71.52,40
  pour Top: 17.4,28.5 17.4,26.9 23.3,26.9 23.3,28.5
  pour Top (rank 6): 0,40 71.51,40 71.51,0.03 0,0.03
D0/RX
  Top 0.152: RP1.8 37.92,24.35 37.7,24.13 37.7,21.48 IC2.30
D1/TX
  Top 0.152: IC2.31 37.38,21.87 37.38,24.78 37.76,25.15 RP1.7
ENC_CLK  (via drill 0.35)
  Top 0.152: IC2.23 38.37,17.24 38.8,17.24 39.78,18.22 39.78,18.77 v39.88,18.87 | v41.15,20.19 42.09,21.13 42.23,21.27 50.29,21.27 50.71,20.85 v50.71,20.68 | v57.99,24 57.99,24.41 58.29,24.71 65.43,24.71 67.11,23.03 67.11,19.96 67.77,19.3 JP1.1
  Bottom 0.152: v39.88,18.87 41.15,20.14 v41.15,20.19 | v50.71,20.68 v50.72,20.67 51.96,20.67 52.69,19.94 53.13,19.94 53.44,20.25 53.44,20.57 53.81,20.93 53.81,21.25 53.99,21.43 55.89,21.43 56.6,22.14 56.6,22.97 56.78,23.16 57.14,23.16 v57.99,24
ENC_DT  (via drill 0.35)
  Top 0.152: IC2.24 39.34,18.6 v39.34,19.47 | v40.53,20.72 40.86,21.05 41.54,21.05 42.07,21.58 50.56,21.58 51.03,21.11 52.29,21.11 52.91,20.49 v52.91,20.47 | v57.24,24 57.53,24.3 57.53,24.62 57.92,25.01 66.04,25.01 67.44,23.62 67.44,22.47 68.07,21.84 JP1.2
  Bottom 0.152: v40.53,20.72 40.53,20.65 v39.34,19.47 | v52.91,20.47 53.14,20.7 53.5,21.06 53.5,21.38 53.86,21.73 55.76,21.73 56.3,22.27 56.3,23.11 56.64,23.46 56.78,23.46 57.24,23.91 v57.24,24
ENC_SW  (via drill 0.35)
  Top 0.152: IC2.25 38.8,19.05 38.8,20.13 v38.62,20.3 | v40.72,21.58 41.64,21.58 41.94,21.88 50.69,21.88 51.16,21.42 52.73,21.42 v52.92,21.23 | v56.48,24 57.8,25.32 66.88,25.32 67.82,24.38 JP1.3
  Bottom 0.152: v40.72,21.58 39.91,21.58 38.64,20.3 v38.62,20.3 | v52.92,21.23 53.73,22.04 55.64,22.04 55.99,22.39 55.99,23.37 56.48,23.86 v56.48,24
GATE
  Top 0.152: IC6.5 23.41,7.4 23.62,7.62 27.21,7.62 27.38,7.45 27.38,6.73 27.43,6.67 | Q2.4 28.03,6.47 27.82,6.67 27.43,6.67 | 27.43,6.67 26.88,6.67 26.73,6.52 Q2.2
LED-
  pour Top: 9.49,16.76 9.49,26.54 6.48,26.54 6.48,30.6 12.83,30.6 12.83,32.76 17.27,32.76 17.27,40 7.62,40 7.62,34.24 5.43,32.38 0,32.38 0,16.76
LED_ENABLE
  Top 0.152: IC4.1 19.79,17.39 20.1,17.7 20.1,18.4 19.85,18.65 19.86,18.66 | 19.87,19.93 20.1,19.7 20.1,18.9 19.86,18.66 | IC4.4 19.9,21.2 | 19.9,21.2 20.1,21 20.1,20.17 19.87,19.93 | IC4.5 19.83,22.47 | 19.83,22.47 20.1,22.2 20.1,21.41 19.9,21.2 | 19.86,23.74 20.1,23.5 20.1,23.1 | 20.1,23.1 20.1,22.75 19.83,22.47 | IC4.7 19.79,25.01 | 19.79,25.01 20.1,24.7 20.1,23.99 19.86,23.74 | IC4.8 19.82,26.28 20.1,26 20.1,25.33 19.79,25.01 | IC4.3 19.87,19.93 | IC4.2 19.86,18.66 | IC4.6 19.86,23.74 | 20.1,23.1 22,23.1 22.4,22.7 25.4,22.7 31.1,17 32.51,17 IC2.10
MISO  (via drill 0.35)
  Top 0.152: IC2.16 34.72,14.97 34.72,14.49 v35.78,13.43 v35.78,13.42 | v38.83,16.07 39.06,16.07 41.05,18.06 41.05,19.42 39.84,20.63 39.84,21.46 40.57,22.19 50.83,22.19 51.28,21.73 52.73,21.73 53.14,22.14 v53.14,22.57 | v53.53,24.27 53.12,24.69 53.12,24.89 52.87,25.13 52.87,27.55 52.6,27.83 52.6,32.65 53.23,33.28 53.86,33.28 54.53,33.95 54.53,36.73 54.94,37.14 JP2.1
  Bottom 0.152: v35.78,13.42 36.11,13.75 36.88,13.75 38.77,15.64 38.77,16 v38.83,16.07 | v53.14,22.57 53.39,22.82 53.39,23.88 53.53,24.03 v53.53,24.27
MOSI  (via drill 0.35)
  Top 0.152: IC2.15 34.71,15.48 34.42,15.19 34.42,14.04 v34.75,13.7 | v52.38,22.57 52.38,22.28 52.14,22.04 51.41,22.04 50.95,22.49 40.4,22.49 39.52,21.61 39.52,20.49 40.72,19.29 40.72,18.2 39.12,16.6 38.6,16.6 38.12,16.12 v38.12,15.8 v38.12,15.79 | v52.77,24 52.81,24.04 52.81,24.76 52.56,25.01 52.56,27.43 52.29,27.7 52.29,33.63 JP2.4
  Bottom 0.152: v34.75,13.7 35.1,14.05 36.75,14.05 38.02,15.33 38.02,15.69 v38.12,15.79 | v52.38,22.57 52.38,23.61 v52.77,24
N$1
  Top 0.152: Q1.1 19.76,3.05 19.6,2.89 19.6,2.4 | 19.6,2.4 19.6,1.95 19.8,1.75 Q1.3 | 19.6,2.4 19.42,2.4 19.17,2.65 19.17,4.34 19.4,4.57 20.71,4.57 R3.2
N$3
  Top 0.254: RP1.3 40.3,25.95 40.68,26.34 41.49,26.34 PWR.A
N$4
  Top 0.152: IC3.2 51.12,27.06 51.68,27.63 51.68,31.15 51.05,31.79 C4.2
N$8
  Top 0.152: IC3.23 48.52,16.91 48.3,16.7 48.2,16.6 45.39,13.79 RP2.2
N$9
  Top 0.152: IC3.22 47.87,17.07 45.39,14.59 RP2.3
N$11
  Top 0.152: TX.C 38.5,11.72 38.5,12.35 40.69,14.55 40.74,14.59 RP2.6
N$18
  Top 0.152: Q2.1 26.08,5.92 26.29,5.71 27.05,5.71 27.38,6.03 Q2.3
N$29
  Top 0.152: RX.C 39.97,12.76 40.4,13.2 40.99,13.79 RP2.7
OVERRIDE_SENSE  (via drill 0.35)
  Top 0.152: OVERRIDE.2 45.1,34.1 44,33 38,33 37.29,33.71 SW2.P$1 35.61,35.54 34.89,34.81 34.89,27.44 36.34,25.99 v36.34,24.36 | IC2.32 36.7,21.9 v36.7,23
  Bottom 0.152: v36.34,24.36 36.7,24.36 v36.7,23
RESET  (via drill 0.35)
  Top 0.152: SW1.2 35.94,29 37,29 | IC2.29 37.41,20.49 37.41,20.77 38.03,21.39 38.03,23.11 v38.27,23.34 | v36.77,26.33 36.77,27 37.21,27.45 39.43,27.45 39.68,27.2 RP1.4 40.25,26.75 40.6,27.1 40.6,28.4 40.2,28.8 40.17,28.8 | 37,29 37.2,29.2 37.2,29.99 C4.1 | 37,29 37.2,28.8 40.17,28.8 | 40.17,28.8 40.59,29.23 40.59,30.33 41.4,31.13 47.68,31.13 v47.74,31.2 | v47.75,32.38 48.26,32.89 48.26,36.19 49.21,37.14 JP2.5
  Bottom 0.152: v38.27,23.34 38.27,23.83 36.77,25.33 v36.77,26.33 | v47.75,32.38 47.74,32.37 v47.74,31.2
RX
  Top 0.152: RP1.1 40.98,24.35 41.44,23.89 50.9,23.89 51.77,24.77 IC3.1
SCK  (via drill 0.35)
  Top 0.152: IC2.17 36.34,15.03 v35.94,14.62 | v51.63,22.57 51.4,22.8 40.21,22.8 39.18,21.76 39.18,20.39 40.41,19.16 40.41,18.35 39,16.93 38.51,16.93 37.4,15.82 v37.4,15.52 | JP2.3 52.42,37.14 51.99,36.7 51.99,27.57 52.26,27.3 v52.26,24.56
  Bottom 0.152: v37.4,15.52 36.83,15.52 v35.94,14.62 | v51.63,22.57 51.63,23.92 v52.26,24.56
SCL  (via drill 0.35)
  Top 0.152: IC2.28 37.73,20.11 37.73,20.64 38.34,21.25 38.34,22.57 39.24,23.47 53.57,23.47 54.1,24 | 54.1,24 54.17,24 54.7,23.47 63.33,23.47 65.94,20.86 IC5.16 | R2.2 54.12,24.02 54.1,24
  Top 0.254: IC5.16 65.94,16.61 66.04,16.51 v66.04,15.87
  Bottom 0.254: v66.04,15.87 SCL.X
SDA  (via drill 0.35)
  Top 0.152: IC2.27 38.06,19.73 38.06,20.53 38.65,21.12 38.65,22.45 39.3,23.1 53.6,23.1 54.14,22.56 | 54.14,22.56 R1.2 | IC5.15 64.67,20.32 61.84,23.16 54.74,23.16 54.14,22.56
  Top 0.254: IC5.15 64.67,16.59 64.77,16.5 v64.77,15.87
  Bottom 0.254: v64.77,15.87 64.78,15.86 64.78,13.34 SDA.X
SQW  (via drill 0.35)
  Top 0.152: IC5.3 63.41,26.06 63.08,25.73 56.31,25.73 56.04,26 v56.04,26.42 | v55,29.28 54.81,29.46 v53.13,29.46 v53.13,29.47 | v39.98,29.36 38.67,29.36 38.4,29.63 38.4,30.69 38.14,30.95 v35.42,30.95 | v34.34,30.98 33.45,30.09 33.45,27.91 31.42,25.87 v31.42,23.15 | v34.19,22.67 34.19,22.13 IC2.1 | v51.15,29.44 49.49,29.44 48.69,30.24 41.84,30.24 v41.12,29.53
  Bottom 0.152: v56.04,26.42 55.47,26.98 55.47,28.8 v55,29.28 | v53.13,29.47 53.1,29.44 v51.15,29.44 | v41.12,29.53 40.95,29.36 v39.98,29.36 | v35.42,30.95 34.37,30.95 v34.34,30.98 | v31.42,23.15 32.34,23.15 32.84,22.65 34.17,22.65 v34.19,22.67
STAT
  Top 0.152: Q1.4 20.35,1.1 20.6,1.35 20.6,1.74 | Q1.2 20.41,2.4 20.6,2.2 20.6,1.74 | 20.6,1.74 21.27,1.74 21.57,2.04 21.57,5.33 21.69,5.46 22.25,5.46 | 22.25,5.46 22.44,5.26 22.44,4.59 R3.1 | IC6.4 22.46,5.66 22.25,5.46
TX
  Top 0.152: IC3.5 49.16,24.76 48.66,24.25 41.68,24.25 40.78,25.15 RP1.2
USB_N  (via drill 0.35)
  Top 0.152: IC3.16 43.97,20.26 43.81,20.42 42.67,20.42 42.31,20.07 42.31,18.15 34.56,10.39 J3.4 34.56,5.53 34.8,5.28 34.8,3 34.6,2.8 v34.5,2.8
  Bottom 0.152: v34.5,2.8 34.5,1.9 34.14,1.53 D-.X
USB_P  (via drill 0.35)
  Top 0.152: IC3.15 43.31,19.92 43.15,20.09 42.96,20.09 42.67,19.8 42.67,18.12 arc-45 42.57,17.89 arc90 42.57,17.4 arc-90 42.57,17.01 41.52,15.96 arc-90 41.13,15.96 arc90 40.79,15.96 39.7,14.87 arc90 39.7,14.52 arc-90 39.7,14.17 38.6,13.08 arc-90 38.26,13.08 arc90 37.77,13.08 37.16,12.48 arc90 37.16,11.99 arc-90 37.16,11.59 36.55,10.97 arc-90 36.15,10.97 arc90 35.79,10.97 35.36,10.54 J3.3 35.36,5.53 35.11,5.28 35.11,3 35.31,2.8 v35.41,2.8
  Bottom 0.152: v35.41,2.8 35.41,1.9 35.78,1.53 D+.X
V_BUCK
  pour Top (isolate 0.254): 24.1,8.02 26.88,8.02 26.88,10.44 28.53,10.44 28.53,13.74 25.63,13.74 25.63,13.38 24.36,13.38 24.36,11.16 24.1,11.16
VBAT
  Top 0.254: B1.+$1 60.39,10 63,10 63.41,10.41 IC5.14
VBUS
  Top 0.254: J3.5 33.76,5.91 33.29,5.45 32.49,5.45 31.79,4.75 31.79,3.95 30.83,2.99 F1.2
VUSB
  Top 0.254: Q1.6 23.44,1.75 23.55,1.64 23.55,1.38 | 23.55,1.38 23.55,1.19 23.46,1.1 Q1.5 | F1.1 26.95,1.39 26.94,1.4 C6.1 25.21,1.44 C9.1 23.58,1.41 23.55,1.38
XTAL_N
  Top 0.152: Y1.1 32.7,20.44 32.7,20.19 32.46,19.96 32.46,19.61 IC2.7
XTAL_P
  Top 0.152: Y1.3 31.29,19.02 31.52,19.02 31.75,19.25 32.12,19.25 IC2.8

### Text on the board
tPlace: RST / SCK / CIPO | COM / COPI / 5V | GND | 5V | SW | DT | CLK | Rotary Encoder | CR1220
bPlace: +24V | Wakeup Light | Simen E. Sørensen October 2020